# Altium project pfc_Project.PrjPcb
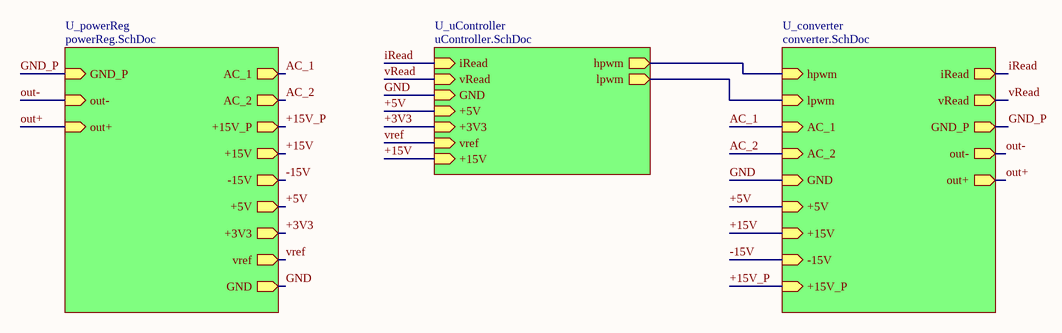
[diagram p0: pfc.SchDoc]
4 sheets, 81 parts. Net scope: hierarchical (ports join the sheet entries above them; power ports are global).
Board file: pfc_PCB.PcbDoc
Sheets:
  pfc.SchDoc
    U_converter = converter.SchDoc
    U_powerReg = powerReg.SchDoc
    U_uController = uController.SchDoc

## Sheet pfc.SchDoc
size A4; SheetNumber: 1; SheetTotal: 4

### Sub-sheets
U_converter = converter.SchDoc: iRead (out), vRead (out), hpwm (in), lpwm (in), AC_1 (in), AC_2 (in), GND_P (out), out- (out), out+ (out), GND (in), +5V (in), +15V (in), -15V (in), +15V_P (in)
U_powerReg = powerReg.SchDoc: AC_1 (out), AC_2 (out), +15V_P (out), +15V (out), -15V (out), +5V (out), +3V3 (out), vref (out), GND_P (in), out- (in), out+ (in), GND (out)
U_uController = uController.SchDoc: iRead (in), vRead (in), hpwm (out), lpwm (out), GND (in), +5V (in), +3V3 (in), vref (in), +15V (in)

### Nets
GND: sheet U_converter/GND, sheet U_powerReg/GND, sheet U_uController/GND
GND_P: sheet U_converter/GND_P, sheet U_converter/out-, sheet U_powerReg/GND_P, sheet U_powerReg/out-  [also labelled out-]
+3V3: sheet U_powerReg/+3V3, sheet U_uController/+3V3
+5V: sheet U_converter/+5V, sheet U_powerReg/+5V, sheet U_uController/+5V
+15V: sheet U_converter/+15V, sheet U_powerReg/+15V, sheet U_uController/+15V
+15V_P: sheet U_converter/+15V_P, sheet U_powerReg/+15V_P
-15V: sheet U_converter/-15V, sheet U_powerReg/-15V
AC_1: sheet U_converter/AC_1, sheet U_powerReg/AC_1
AC_2: sheet U_converter/AC_2, sheet U_powerReg/AC_2
hpwm: sheet U_converter/hpwm, sheet U_uController/hpwm
iRead: sheet U_converter/iRead, sheet U_uController/iRead
lpwm: sheet U_converter/lpwm, sheet U_uController/lpwm
out+: sheet U_converter/out+, sheet U_powerReg/out+
vRead: sheet U_converter/vRead, sheet U_uController/vRead
vref: sheet U_powerReg/vref, sheet U_uController/vref

## Sheet converter.SchDoc
size A4; SheetNumber: 3; SheetTotal: 4
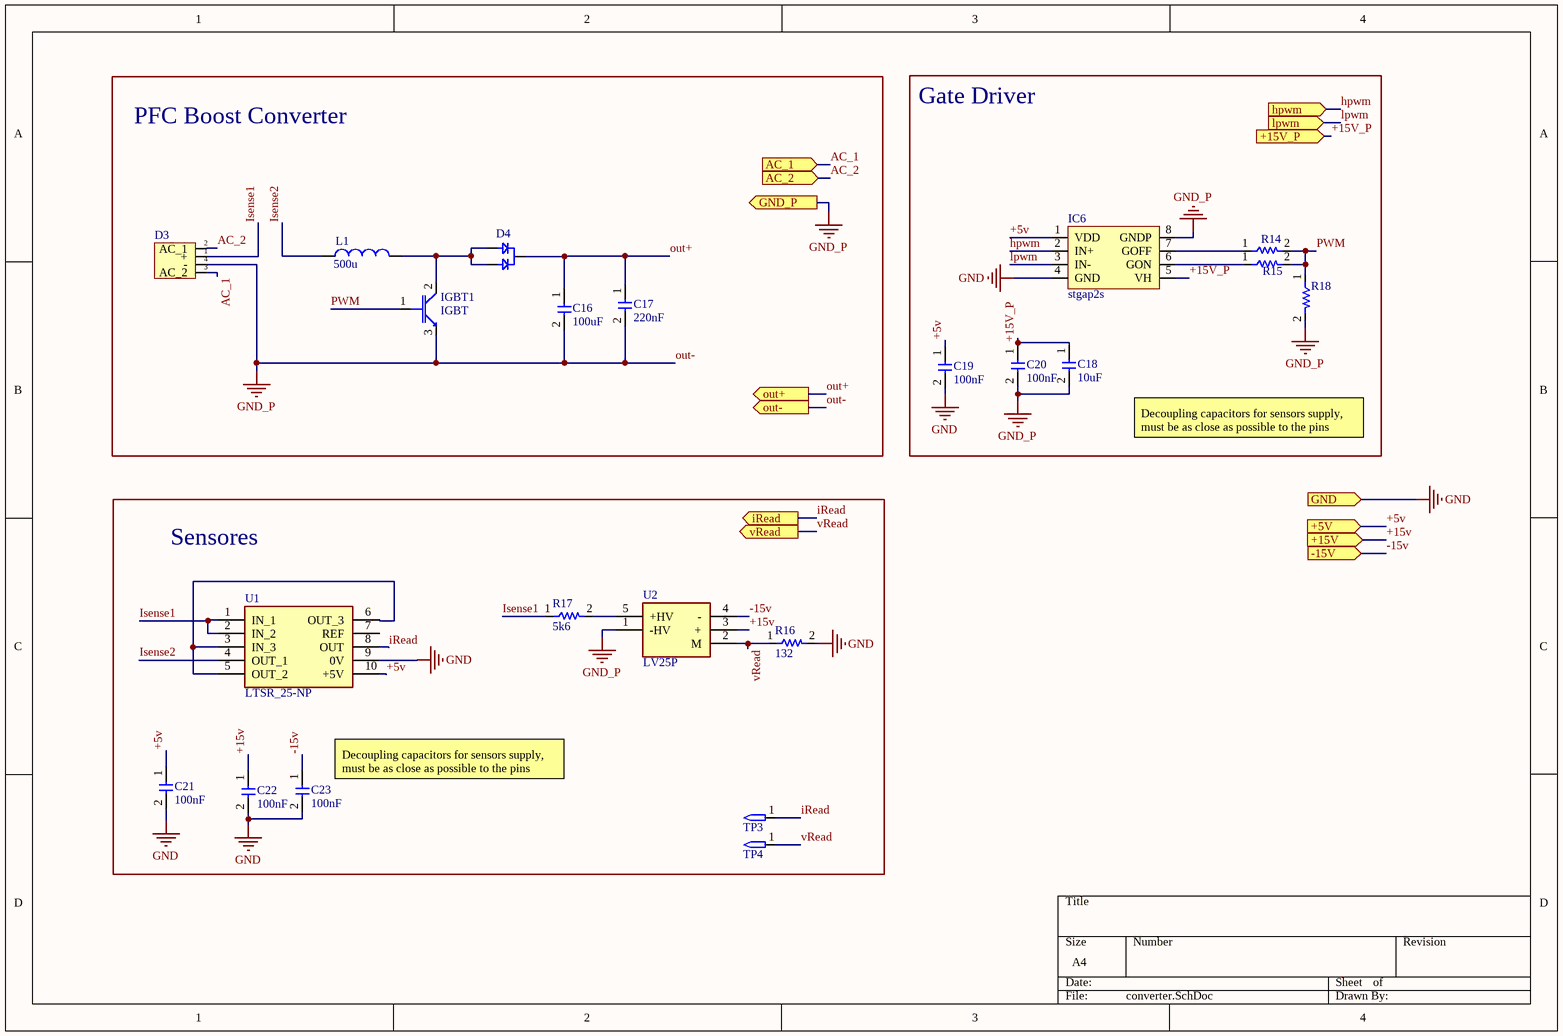
[diagram p1: converter.SchDoc]

### Parts
C16  100uF  [CAP 20x12.5]
C17  220nF  [CAPACITOR 220nF]
C18  10uF  [CAPACITOR_0805]
C19  100nF  [CAPACITOR_0805]
C20  100nF  [CAPACITOR_0805]
C21  100nF  [CAPACITOR_0805]
C22  100nF  [CAPACITOR_0805]
C23  100nF  [CAPACITOR_0805]
D3  rectifierBridge  [GBI10M]  (value not drawn)
D4  Diode dual  [D2PAK]  (value not drawn)
IC6  stgap2s  [SO-8]
IGBT1  IGBT  [D2PAK]
L1  500u  [INDUCTOR 500u]
R14  Resistor  [RESISTOR_0805]  (value not drawn)
R15  Resistor  [RESISTOR_0805]  (value not drawn)
R16  132  [RESISTOR_0805]
R17  5k6  [RESISTOR_0805]
R18  Resistor  [RESISTOR_0805]  (value not drawn)
TP3  TestPoint  [TestPoint]  (value not drawn)
TP4  TestPoint  [TestPoint]  (value not drawn)
U1  LTSR_25-NP  [LTSR25-NP]
U2  LV25P  [LV-25-P/LV-20-P]

### Blocks framed on the sheet
PFC Boost Converter: C16 C17 D3 D4 IGBT1 L1
Gate Driver: C18-C20 IC6 R14 R15 R18
Sensores: C21-C23 R16 R17 TP3 TP4 U1 U2

### Ports
+5V (in, see pfc[3B], powerReg[3C], uController[4A]), +15V (in, see pfc[3B], powerReg[3B], uController[4C]), +15V_P (in, see pfc[3B], powerReg[2A]), -15V (in, see pfc[3B], powerReg[3B]), AC_1 (in, see pfc[3B], powerReg[2A]), AC_2 (in, see pfc[3B], powerReg[2A]), GND (in, see pfc[3B], powerReg[3C], uController[4A]), GND_P (out, see pfc[3B], powerReg[2A]), hpwm (in, see pfc[3A], uController[2A]), iRead (out, see pfc[3A], uController[4A]), lpwm (in, see pfc[3B], uController[2A]), out+ (out, see pfc[3B], powerReg[2A]), out- (out, see pfc[3B], powerReg[2A]), vRead (out, see pfc[3B], uController[4A])

### Nets
GND: C19.2 C21.2 C22.2 C23.2 IC6.4(GND) R16.2 U1.9(0V) ; port GND
GND_P: C16.2 C17.2 C18.2 C20.2 D3.4(-) IC6.8(GNDP) IGBT1.3 R18.2 U2.1(-HV) ; port GND_P, port out-  [also labelled out-]
+5V: C19.1 C21.1 IC6.1(VDD) U1.10(+5V) ; port +5V
+15V: C22.1 U2.3(+) ; port +15V
+15V_P: C18.1 C20.1 IC6.5(VH) ; port +15V_P
-15V: C23.1 U2.4(-) ; port -15V
AC_1: D3.3(AC_2) ; port AC_1
AC_2: D3.2(AC_1) ; port AC_2
hpwm: IC6.2(IN+) ; port hpwm
iRead: TP3.1 U1.8(OUT) ; port iRead
Isense1: D3.1(+) R17.1 U1.1(IN_1) U1.2(IN_2)
Isense2: L1.1 U1.4(OUT_1)
lpwm: IC6.3(IN-) ; port lpwm
out+: C16.1 C17.1 D4.2 ; port out+
PWM: IGBT1.1 R14.2 R15.2 R18.1
vRead: R16.1 TP4.1 U2.2(M) ; port vRead
NetD4_1: D4.1 D4.3 IGBT1.2 L1.2
NetIC6_6: IC6.6(GON) R15.1
NetIC6_7: IC6.7(GOFF) R14.1
NetR17_2: R17.2 U2.5(+HV)
NetU1_3: U1.3(IN_3) U1.5(OUT_2) U1.6(OUT_3)

Not connected (* = marked no-connect by the designer): U1 7(REF)

### Notes on the sheet
- Decoupling capacitors for sensors supply, must be as close as possible to the pins
- (near C23) Decoupling capacitors for sensors supply, must be as close as possible to the pins

### Library data of the parts
C16-C23 = Capacitor
L1 = Inductor: SimulationGenericComponent: True
R16 = Resistor: 82.5 mW
R17 = Resistor: 140 mW
U1 = LTSR_25-NP: Undefined or Miscellaneous; Manufacturer_Name: LEM; Manufacturer_Part_Number: LTSR 25-NP; Datasheet Link: https://datasheet.datasheetarchive.com/originals/distributors/Datasheets-16/DSA-314824.pdf
U2 = LV25P: Undefined or Miscellaneous; Manufacturer_Name: LEM; Manufacturer_Part_Number: LV25P

## Sheet powerReg.SchDoc
size A4; SheetNumber: 4; SheetTotal: 4
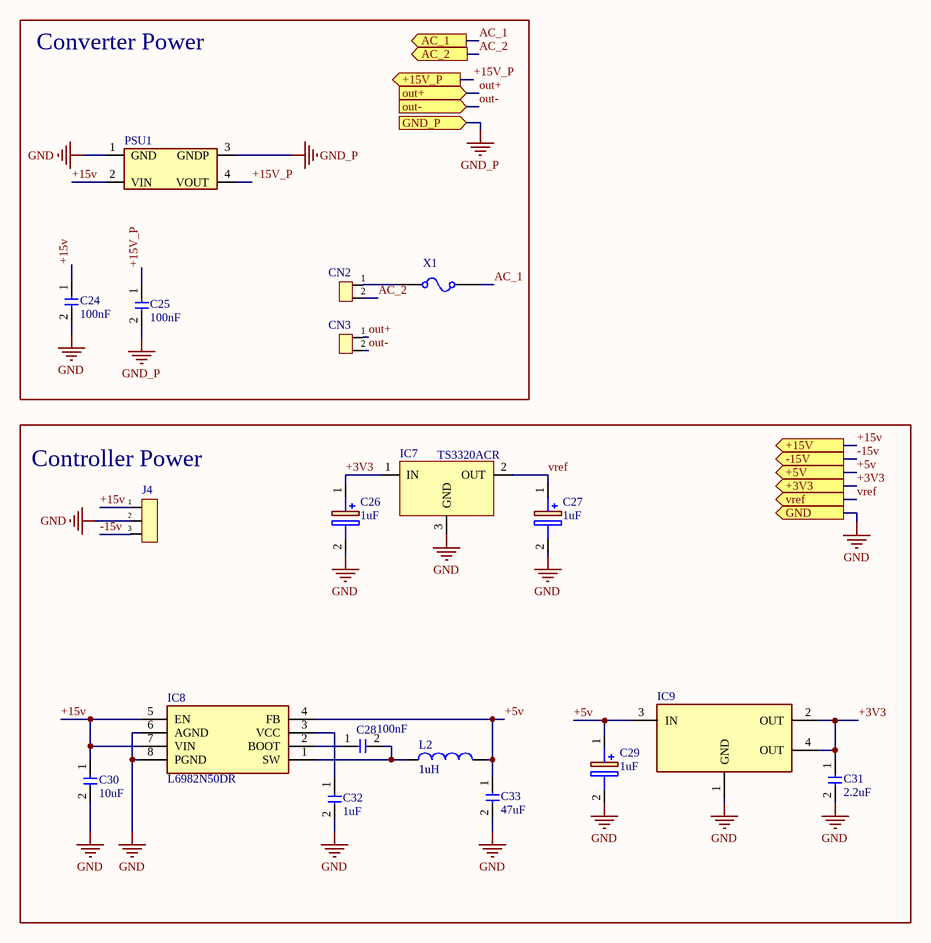
[diagram p2: powerReg.SchDoc]

### Parts
C24  100nF  [CAPACITOR_0805]
C25  100nF  [CAPACITOR_0805]
C26  1uF  [Capacitor 0805 polaryzed]
C27  1uF  [Capacitor 0805 polaryzed]
C28  100nF  [CAPACITOR_0805]
C29  1uF  [Capacitor 0805 polaryzed]
C30  10uF  [CAPACITOR_0805]
C31  2.2uF  [CAPACITOR_0805]
C32  1uF  [CAPACITOR_0805]
C33  47uF  [CAPACITOR_1210]
CN2  conector 2Pin  [NC6P10802]  (value not drawn)
CN3  conector 2Pin  [NC6P10802]  (value not drawn)
IC7  TS3320ACR  [SOT323]
IC8  L6982N50DR  [SO-8]
IC9  Linear Regulator  [SOT-223-4]  (value not drawn)
J4  Conector 1x3P  [Conector 1x3 Screw]  (value not drawn)
L2  1uH  value 1u  [Inductor 1005]
PSU1  PDSE1-S15-S15-S  [PDSE1-S15-S15-S]  (value not drawn)
X1  Fuse  [Fuse 1206]  (value not drawn)

### Blocks framed on the sheet
Converter Power: C24 C25 CN2 CN3 PSU1 X1
Controller Power: C26-C33 IC7-IC9 J4 L2

### Ports
+3V3 (out, see pfc[2B], uController[4A]), +5V (out, see pfc[2B], converter[4C], uController[4A]), +15V (out, see pfc[2B], converter[4C], uController[4C]), +15V_P (out, see pfc[2B], converter[4A]), -15V (out, see pfc[2B], converter[4C]), AC_1 (out, see pfc[2A], converter[2A]), AC_2 (out, see pfc[2B], converter[2A]), GND (out, see pfc[2B], converter[4B], uController[4A]), GND_P (in, see pfc[1A], converter[2A]), out+ (in, see pfc[1B], converter[2B]), out- (in, see pfc[1B], converter[2B]), vref (out, see pfc[2B], uController[4A])

### Nets
GND: C24.2 C26.2(-) C27.2(-) C29.2(-) C30.2 C31.2 C32.2 C33.2 IC7.3(GND) IC8.6(AGND) IC8.8(PGND) IC9.1(GND) J4.2 PSU1.1(GND) ; port GND
GND_P: C25.2 CN3.2 PSU1.3(GNDP) ; port GND_P, port out-  [also labelled out-]
+3V3: C26.1(+) C31.1 IC7.1(IN) IC9.2(OUT) IC9.4(OUT) ; port +3V3
+5V: C29.1(+) C33.1 IC8.4(FB) IC9.3(IN) L2.2 ; port +5V
+15V: C24.1 C30.1 IC8.5(EN) IC8.7(VIN) J4.1 PSU1.2(VIN) ; port +15V
+15V_P: C25.1 PSU1.4(VOUT) ; port +15V_P
-15V: J4.3 ; port -15V
AC_1: X1.2 ; port AC_1
AC_2: CN2.2 ; port AC_2
out+: CN3.1 ; port out+
vref: C27.1(+) IC7.2(OUT) ; port vref
NetC28_1: C28.1 IC8.2(BOOT)
NetC28_2: C28.2 IC8.1(SW) L2.1
NetC32_1: C32.1 IC8.3(VCC)
NetCN2_1: CN2.1 X1.1

### Library data of the parts
C24 C25 C28 C30-C33 = Capacitor
C26 C27 C29 = Capacitor polaryzed
L2 = Inductor: SimulationGenericComponent: True
X1 = Fuse: RESISTANCE: 1m; SimulationGenericComponent: True; CURRENT: 1

## Sheet uController.SchDoc
size A4; SheetNumber: 2; SheetTotal: 4
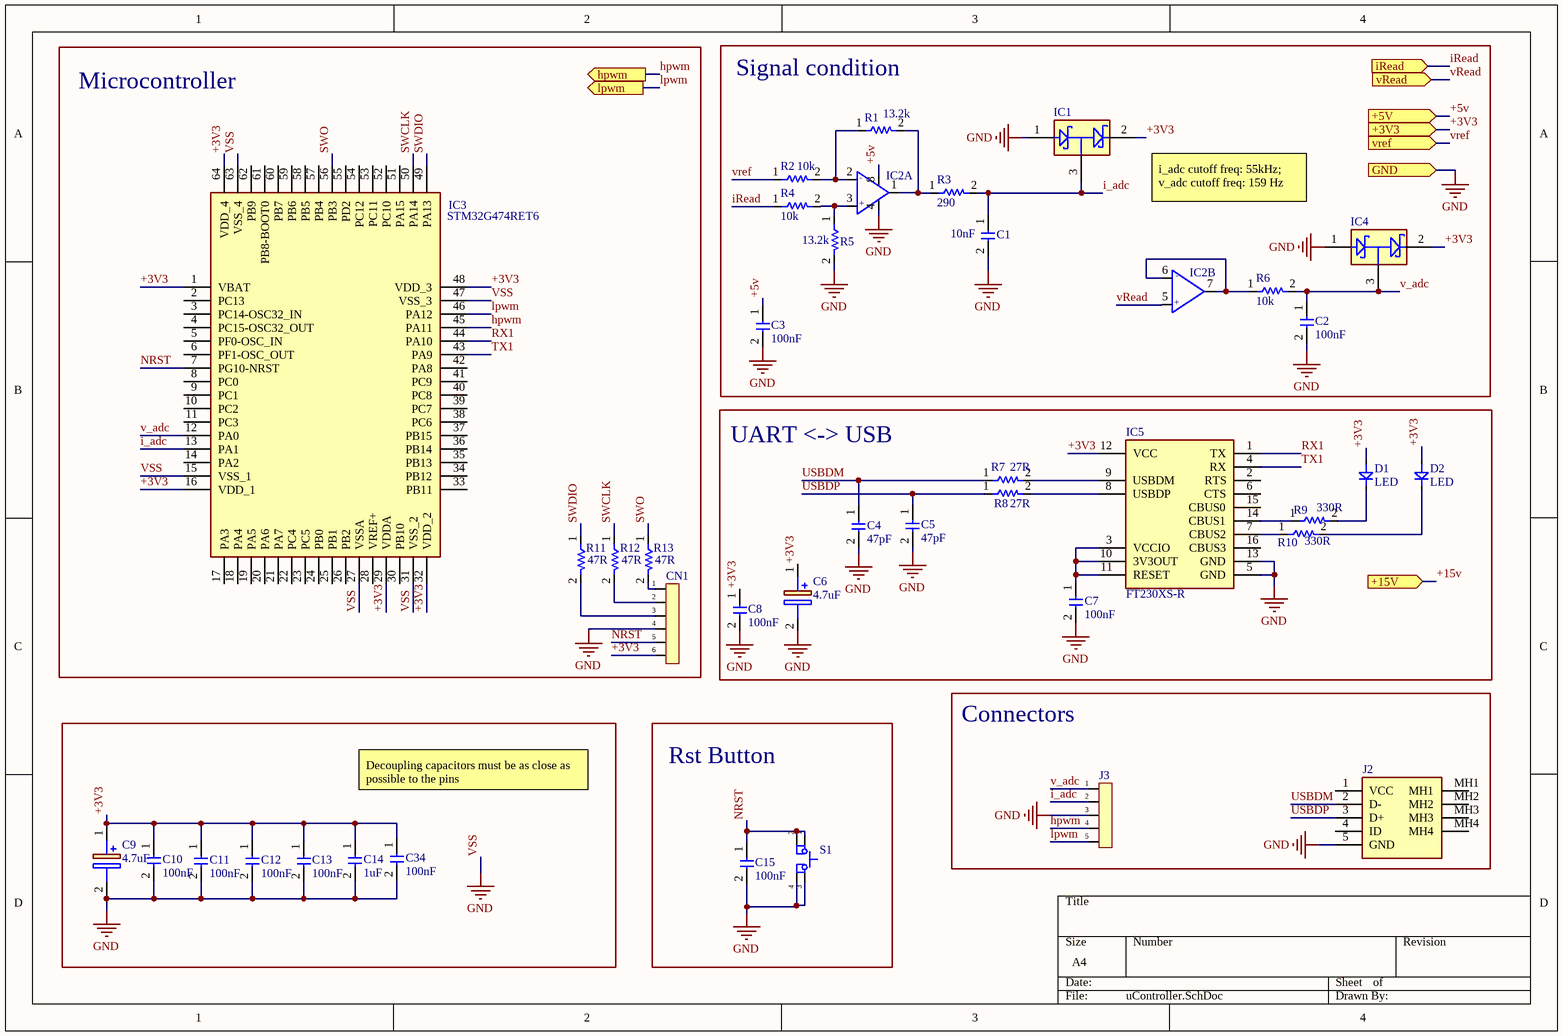
[diagram p3: uController.SchDoc]

### Parts
C1  10nF  [CAPACITOR_0805]
C2  100nF  [CAPACITOR_0805]
C3  100nF  [CAPACITOR_0805]
C4  47pF  [CAPACITOR_0805]
C5  47pF  [CAPACITOR_0805]
C6  4.7uF  [Capacitor 0805 polaryzed]
C7  100nF  [CAPACITOR_0805]
C8  100nF  [CAPACITOR_0805]
C9  4.7uF  [Capacitor 0805 polaryzed]
C10  100nF  [CAPACITOR_0805]
C11  100nF  [CAPACITOR_0805]
C12  100nF  [CAPACITOR_0805]
C13  100nF  [CAPACITOR_0805]
C14  1uF  [CAPACITOR_0805]
C15  100nF  [CAPACITOR_0805]
C34  100nF  [CAPACITOR_0805]
CN1  Conector 1x6P  [Header 2x3]  (value not drawn)
D1  LED  [LED 0805]
D2  LED  [LED 0805]
IC1  bat54s  [BAT54S]  (value not drawn)
IC2  TSX712IDT  [SO-8]  (value not drawn)  (parts A,B of 2)
IC3  STM32G474RET6  [QFP50P1200X1200X160-64N]
IC4  bat54s  [BAT54S]  (value not drawn)
IC5  FT230XS-R  [SSOP-16]
J2  UJ2-MIBH2-4-SMT-TR  [UJ2MIBH24SMTTR]  (value not drawn)
J3  Conector 1x5P  [HEADER 1X5]  (value not drawn)
R1  13.2k  [RESISTOR_0805]
R2  10k  [RESISTOR_0805]
R3  290  [RESISTOR_0805]
R4  10k  [RESISTOR_0805]
R5  13.2k  [RESISTOR_0805]
R6  10k  [RESISTOR_0805]
R7  27R  [RESISTOR_0805]
R8  27R  [RESISTOR_0805]
R9  330R  [RESISTOR_0805]
R10  330R  [RESISTOR_0805]
R11  47R  [RESISTOR_0805]
R12  47R  [RESISTOR_0805]
R13  47R  [RESISTOR_0805]
S1  pushButton  [Push_Button]  (value not drawn)

### Blocks framed on the sheet
Microcontroller: CN1 IC3 R11-R13
Signal condition: C1-C3 IC1 IC2 IC4 R1-R6
UART <-> USB: C4-C8 D1 D2 IC5 R7-R10
Rst Button: C15 S1
Connectors: J2 J3

### Ports
+3V3 (in, see pfc[2B], powerReg[3C]), +5V (in, see pfc[2B], converter[4C], powerReg[3C]), +15V (in, see pfc[2B], converter[4C], powerReg[3B]), GND (in, see pfc[2B], converter[4B], powerReg[3C]), hpwm (out, see pfc[3A], converter[4A]), iRead (in, see pfc[2A], converter[2C]), lpwm (out, see pfc[3B], converter[4A]), vRead (in, see pfc[2B], converter[2C]), vref (in, see pfc[2B], powerReg[3C])

### Nets
GND: C1.2 C2.2 C3.2 C4.2 C5.2 C6.2(-) C7.2 C8.2 C9.2(-) C10.2 C11.2 C12.2 C13.2 C14.2 C15.2 C34.2 CN1.4 IC1.1(IN) IC2.4 IC3.15(VSS_1) IC3.27(VSSA) IC3.31(VSS_2) IC3.47(VSS_3) IC3.63(VSS_4) IC4.1(IN) IC5.5(GND) IC5.13(GND) J2.5(GND) J3.3 R5.2 S1.3 S1.4 ; port GND  [also labelled VSS]
+3V3: C6.1(+) C8.1 C9.1(+) C10.1 C11.1 C12.1 C13.1 C14.1 C34.1 CN1.6 D1.2 D2.2 IC1.2(OUT) IC3.1(VBAT) IC3.16(VDD_1) IC3.29(VDDA) IC3.32(VDD_2) IC3.48(VDD_3) IC3.64(VDD_4) IC4.2(OUT) IC5.12(VCC) ; port +3V3
+5V: C3.1 IC2.8 ; port +5V
hpwm: IC3.45(PA11) J3.4 ; port hpwm
i_adc: C1.1 IC1.3(COM) IC3.13(PA1) J3.2 R3.2
iRead: R4.1 ; port iRead
lpwm: IC3.46(PA12) J3.5 ; port lpwm
NRST: C15.1 CN1.5 IC3.7(PG10-NRST) S1.1 S1.2
RX1: IC3.44(PA10) IC5.1(TX)
SWCLK: IC3.50(PA14) R12.1
SWDIO: IC3.49(PA13) R11.1
SWO: IC3.56(PB3) R13.1
TX1: IC3.43(PA9) IC5.4(RX)
USBDM: C4.1 J2.2(D-) R7.1
USBDP: C5.1 J2.3(D+) R8.1
v_adc: C2.1 IC3.12(PA0) IC4.3(COM) J3.1 R6.2
vRead: IC2.5 ; port vRead
vref: R2.1 ; port vref
NetC7_1: C7.1 IC5.3(VCCIO) IC5.10(3V3OUT) IC5.11(RESET)
NetCN1_1: CN1.1 R13.2
NetCN1_2: CN1.2 R12.2
NetCN1_3: CN1.3 R11.2
NetD1_1: D1.1 R9.2
NetD2_1: D2.1 R10.2
NetIC2_1: IC2.1 R1.2 R3.1
NetIC2_2: IC2.2 R1.1 R2.2
NetIC2_3: IC2.3 R4.2 R5.1
NetIC2_6: IC2.6 IC2.7 R6.1
NetIC5_7: IC5.7(CBUS2) R10.1
NetIC5_8: IC5.8(USBDP) R8.2
NetIC5_9: IC5.9(USBDM) R7.2
NetIC5_14: IC5.14(CBUS1) R9.1

Not connected (* = marked no-connect by the designer): IC3 2(PC13) 3(PC14-OSC32_IN) 4(PC15-OSC32_OUT) 5(PF0-OSC_IN) 6(PF1-OSC_OUT) 8(PC0) 9(PC1) 10(PC2) 11(PC3) 14(PA2) 17(PA3) 18(PA4) 19(PA5) 20(PA6) 21(PA7) 22(PC4) 23(PC5) 24(PB0) 25(PB1) 26(PB2) 28(VREF+) 30(PB10) 33(PB11) 34(PB12) 35(PB13) 36(PB14) 37(PB15) 38(PC6) 39(PC7) 40(PC8) 41(PC9) 42(PA8) 51(PA15) 52(PC10) 53(PC11) 54(PC12) 55(PD2) 57(PB4) 58(PB5) 59(PB6) 60(PB7) 61(PB8-BOOT0) 62(PB9); IC5 2(RTS) 6(CTS) 15(CBUS0) 16(CBUS3); J2 1(VCC) 4(ID) MH1 MH2 MH3 MH4

### Notes on the sheet
- i_adc cutoff freq: 55kHz; v_adc cutoff freq: 159 Hz
- Decoupling capacitors must be as close as possible to the pins
- (in symbol TSX712IDT, part A) -; +
- (in symbol TSX712IDT, part B) -; +

### Library data of the parts
C1-C5 C7 C8 C10-C15 C34 = Capacitor
C6 C9 = Capacitor polaryzed
IC3 = STM32G474RET6: Integrated Circuit; Manufacturer_Name: STMicroelectronics; Datasheet Link: https://www.st.com/resource/en/datasheet/stm32g474re.pdf; Height: 1.6mm; Manufacturer_Part_Number: STM32G474RET6; Mouser Part Number: 511-STM32G474RET6; Mouser Price/Stock: https://www.mouser.co.uk/ProductDetail/STMicroelectronics/STM32G474RET6?qs=PzGy0jfpSMvUBs7PMTDqlg%3D%3D; Arrow Part Number: STM32G474RET6; Arrow Price/Stock: https://www.arrow.com/en/products/stm32g474ret6/stmicroelectronics?region=nac
J2 = UJ2-MIBH2-4-SMT-TR: Connector; Manufacturer_Name: CUI Devices; Datasheet Link: https://www.cui.com/product/resource/digikeypdf/uj2-mibh2-4-smt.pdf; Height: 2.5mm; Manufacturer_Part_Number: UJ2-MIBH2-4-SMT-TR; Mouser Part Number: 490-UJ2-MIBH2-4-SMT; Mouser Price/Stock: https://www.mouser.co.uk/ProductDetail/CUI-Devices/UJ2-MIBH2-4-SMT-TR?qs=5mqXD9RfOg1yxHIpPvPxvQ%3D%3D; Arrow Part Number: UJ2-MIBH2-4-SMT-TR; Arrow Price/Stock: https://www.arrow.com/en/products/uj2-mibh2-4-smt-tr/cui-devices?region=nac
R1-R13 = Resistor

## Nets that join several sheets
GND: converter (7 pins), powerReg (14 pins), uController (32 pins)
GND_P: converter (9 pins), powerReg (C25.2 CN3.2 PSU1.3)
+3V3: powerReg (5 pins), uController (21 pins)
+5V: converter (C19.1 C21.1 IC6.1 U1.10), powerReg (5 pins), uController (C3.1 IC2.8)
+15V: converter (C22.1 U2.3), powerReg (6 pins)
+15V_P: converter (C18.1 C20.1 IC6.5), powerReg (C25.1 PSU1.4)
-15V: converter (C23.1 U2.4), powerReg (J4.3)
AC_1: converter (D3.3), powerReg (X1.2)
AC_2: converter (D3.2), powerReg (CN2.2)
hpwm: converter (IC6.2), uController (IC3.45 J3.4)
iRead: converter (TP3.1 U1.8), uController (R4.1)
lpwm: converter (IC6.3), uController (IC3.46 J3.5)
out+: converter (C16.1 C17.1 D4.2), powerReg (CN3.1)
vRead: converter (R16.1 TP4.1 U2.2), uController (IC2.5)
vref: powerReg (C27.1 IC7.2), uController (R2.1)